# Altium schematic sheet 2312_SchemaBloc.SchDoc
size A3; Author: Miguel Santos; Organization: ETML-ES; Address1: Avenue Recordon 1; Address2: 1004 Lausanne; Address3: Switzerland; SheetNumber: 1; SheetTotal: 7; Version: 1.0
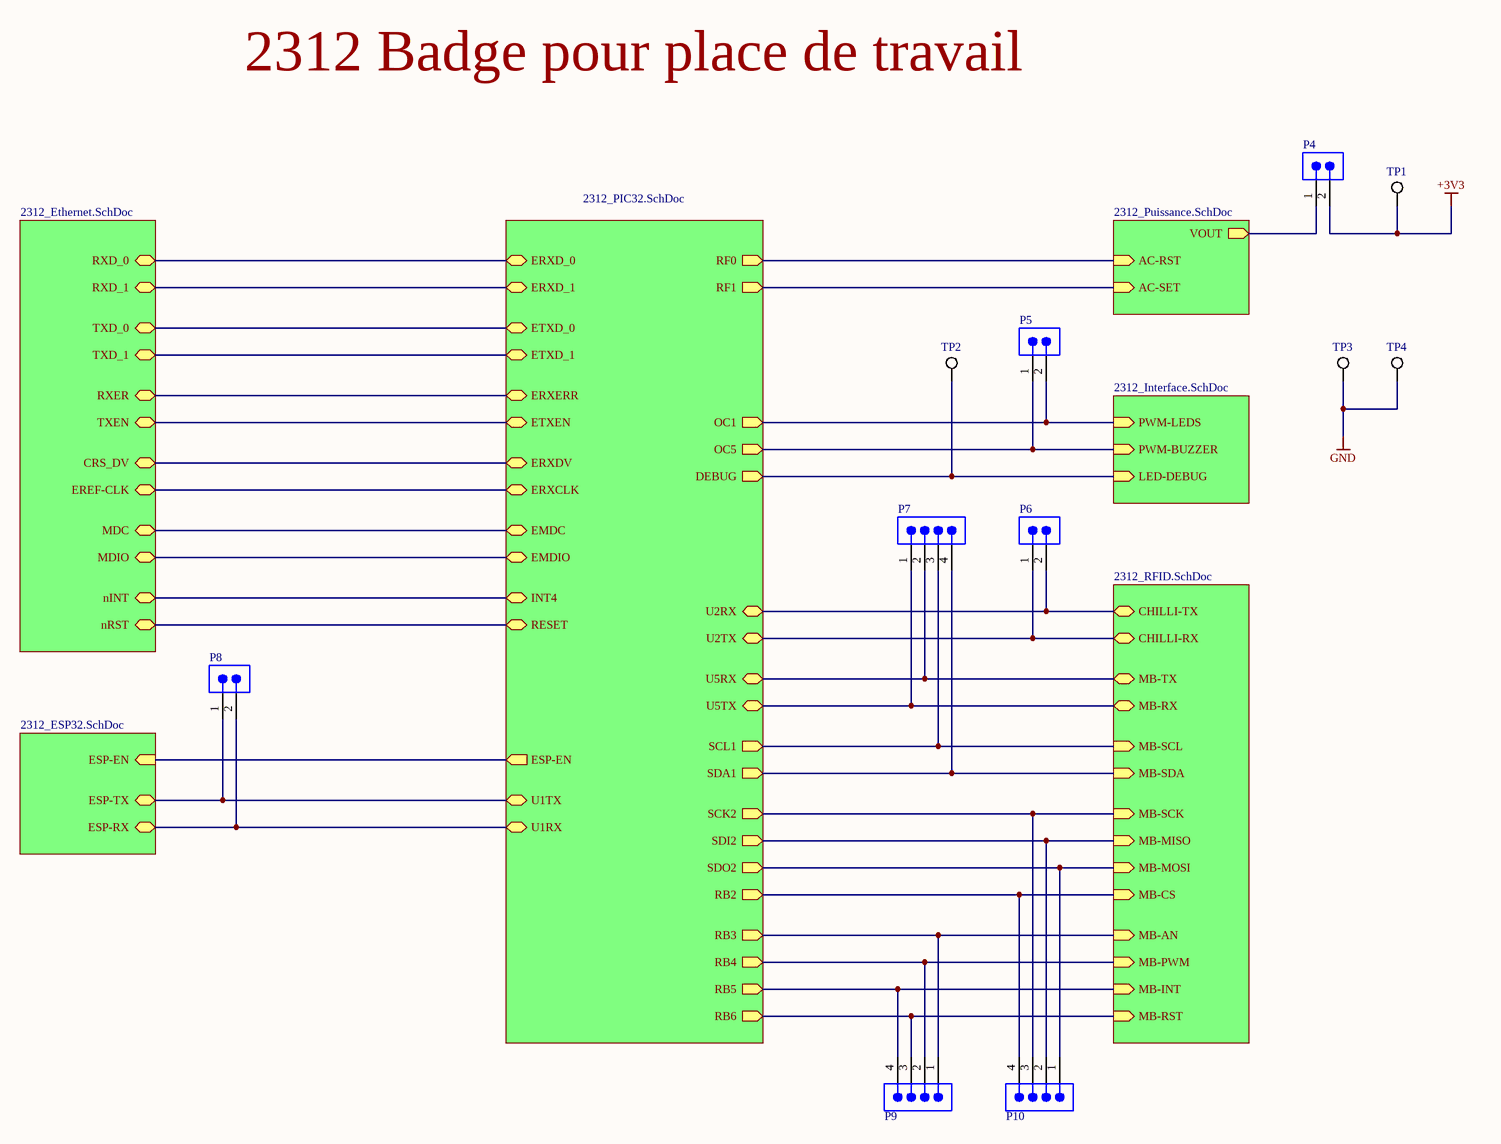
[diagram p0: 2312_SchemaBloc.SchDoc]

## Parts
P4  61300211121  [61300211121]  (value not drawn)
P5  61300211121  [61300211121]  (value not drawn)
P6  61300211121  [61300211121]  (value not drawn)
P7  61300411121  [61300411121]  (value not drawn)
P8  61300211121  [61300211121]  (value not drawn)
P9  61300411121  [61300411121]  (value not drawn)
P10  61300411121  [61300411121]  (value not drawn)
TP1  5019  [KSTN-5019_V]  (value not drawn)
TP2  5019  [KSTN-5019_V]  (value not drawn)
TP3  5019  [KSTN-5019_V]  (value not drawn)
TP4  5019  [KSTN-5019_V]  (value not drawn)

## Sub-sheets
Communication = 2312_RFID.SchDoc: MB-AN (in), MB-RST (in), MB-CS (in), MB-SCK (in), MB-MISO (in), MB-MOSI (in), MB-PWM (in), MB-INT (in), MB-RX (bidir), MB-TX (bidir), MB-SCL (in), MB-SDA (in), CHILLI-RX (bidir), CHILLI-TX (bidir)
ESP32 = 2312_ESP32.SchDoc: ESP-RX (bidir), ESP-EN (in), ESP-TX (bidir)
Ethernet = 2312_Ethernet.SchDoc: CRS_DV (bidir), MDIO (bidir), MDC (bidir), nRST (bidir), RXER (bidir), RXD_0 (bidir), RXD_1 (bidir), nINT (bidir), TXEN (bidir), TXD_0 (bidir), TXD_1 (bidir), EREF-CLK (bidir)
Interface = 2312_Interface.SchDoc: PWM-BUZZER (in), PWM-LEDS (in), LED-DEBUG (in)
Microcontrôleur = 2312_PIC32.SchDoc: ETXEN (bidir), ETXD_0 (bidir), ETXD_1 (bidir), U5RX (bidir), U5TX (bidir), EMDC (bidir), U2RX (bidir), U2TX (bidir), SDA1 (out), SCL1 (out), INT4 (bidir), OC1 (out), EMDIO (bidir), U1RX (bidir), U1TX (bidir), OC5 (out), RF0 (out), RF1 (out), ERXD_1 (bidir), ERXD_0 (bidir), ERXDV (bidir), ERXERR (bidir), RB3 (out), RB4 (out), RB5 (out), RB6 (out), ESP-EN (out), RB2 (out), SCK2 (out), SDI2 (out), SDO2 (out), RESET (bidir), ERXCLK (bidir), DEBUG (out)
Puissance = 2312_Puissance.SchDoc: VOUT (out), AC-SET (in), AC-RST (in)

## Nets
+3V3: P4.2 TP1.1
GND: TP3.1 TP4.1
NetP4_1: P4.1 ; sheet Puissance/VOUT
NetP5_1: P5.1 ; sheet Microcontrôleur/OC5, sheet Interface/PWM-BUZZER
NetP5_2: P5.2 ; sheet Microcontrôleur/OC1, sheet Interface/PWM-LEDS
NetP6_1: P6.1 ; sheet Microcontrôleur/U2TX, sheet Communication/CHILLI-RX
NetP6_2: P6.2 ; sheet Microcontrôleur/U2RX, sheet Communication/CHILLI-TX
NetP7_1: P7.1 ; sheet Microcontrôleur/U5TX, sheet Communication/MB-RX
NetP7_2: P7.2 ; sheet Microcontrôleur/U5RX, sheet Communication/MB-TX
NetP7_3: P7.3 ; sheet Microcontrôleur/SCL1, sheet Communication/MB-SCL
NetP7_4: P7.4 ; sheet Microcontrôleur/SDA1, sheet Communication/MB-SDA
NetP8_1: P8.1 ; sheet Microcontrôleur/U1TX, sheet ESP32/ESP-TX
NetP8_2: P8.2 ; sheet Microcontrôleur/U1RX, sheet ESP32/ESP-RX
NetP9_1: P9.1 ; sheet Microcontrôleur/RB3, sheet Communication/MB-AN
NetP9_2: P9.2 ; sheet Microcontrôleur/RB4, sheet Communication/MB-PWM
NetP9_3: P9.3 ; sheet Microcontrôleur/RB6, sheet Communication/MB-RST
NetP9_4: P9.4 ; sheet Microcontrôleur/RB5, sheet Communication/MB-INT
NetP10_1: P10.1 ; sheet Microcontrôleur/SDO2, sheet Communication/MB-MOSI
NetP10_2: P10.2 ; sheet Microcontrôleur/SDI2, sheet Communication/MB-MISO
NetP10_3: P10.3 ; sheet Microcontrôleur/SCK2, sheet Communication/MB-SCK
NetP10_4: P10.4 ; sheet Microcontrôleur/RB2, sheet Communication/MB-CS
NetTP2_1: TP2.1 ; sheet Microcontrôleur/DEBUG, sheet Interface/LED-DEBUG
(unnamed): sheet Puissance/AC-SET, sheet Microcontrôleur/RF1
(unnamed): sheet Puissance/AC-RST, sheet Microcontrôleur/RF0
(unnamed): sheet Microcontrôleur/ETXEN, sheet Ethernet/TXEN
(unnamed): sheet Microcontrôleur/ETXD_0, sheet Ethernet/TXD_0
(unnamed): sheet Microcontrôleur/ETXD_1, sheet Ethernet/TXD_1
(unnamed): sheet Microcontrôleur/EMDC, sheet Ethernet/MDC
(unnamed): sheet Microcontrôleur/INT4, sheet Ethernet/nINT
(unnamed): sheet Microcontrôleur/EMDIO, sheet Ethernet/MDIO
(unnamed): sheet Microcontrôleur/ERXD_1, sheet Ethernet/RXD_1
(unnamed): sheet Microcontrôleur/ERXD_0, sheet Ethernet/RXD_0
(unnamed): sheet Microcontrôleur/ERXDV, sheet Ethernet/CRS_DV
(unnamed): sheet Microcontrôleur/ERXERR, sheet Ethernet/RXER
(unnamed): sheet Microcontrôleur/ESP-EN, sheet ESP32/ESP-EN
(unnamed): sheet Microcontrôleur/RESET, sheet Ethernet/nRST
(unnamed): sheet Microcontrôleur/ERXCLK, sheet Ethernet/EREF-CLK

## Notes on the sheet
- 2312 Badge pour place de travail
- Fichier :
- a
- Date :
- Heure :
- Version :
- Auteur :
- Modif.
- b
- c
- d
- Projet :
- No :
- Nb feuilles
- Feuille n°
- Chemin :

## Library data of the parts
P4-P6 P8 = 61300211121: WR-PHD Pin Header, THT, Vertical, pitch 2.54mm, 1 Row, 2P; Manufacturer: Wurth Elektronik; Contact Resistance: 20mΩ; Rated Current: 3A; Working Voltage: 250V; Withstanding Voltage: 500V; ComponentLink1Description: Website Link; ComponentLink1URL: https://www.we-online.com/redexpert/article/61300211121?ad; ComponentLink2Description: Datasheet Link; ComponentLink2URL: https://www.we-online.com/redexpert/spec/61300211121?ad; Manufacturer Part Number: 61300211121; Category: Board-to-Board Connectors; Match Code: WR-PHD; Mount: Through Hole; Operating Temperature Max: 105°C; Operating Temperature Min: -40°C; Packaging: Bag; Gender: Pin Header; Number of Pins: 2; Number of Rows: 1; Orientation: Vertical; Pitch: 2.54mm
P7 P9 P10 = 61300411121: WR-PHD Pin Header, THT, Vertical, pitch 2.54mm, 1 Row, 4P; Manufacturer: Wurth Elektronik; Contact Resistance: 20mΩ; Rated Current: 3A; Working Voltage: 250V; Withstanding Voltage: 500V; ComponentLink1Description: Website Link; ComponentLink1URL: https://www.we-online.com/redexpert/article/61300411121?ad; ComponentLink2Description: Datasheet Link; ComponentLink2URL: https://www.we-online.com/redexpert/spec/61300411121?ad; Manufacturer Part Number: 61300411121; Category: Board-to-Board Connectors; Match Code: WR-PHD; Mount: Through Hole; Operating Temperature Max: 105°C; Operating Temperature Min: -40°C; Packaging: Bag; Gender: Pin Header; Number of Pins: 4; Number of Rows: 1; Orientation: Vertical; Pitch: 2.54mm
TP1-TP4 = CMP-1672-00008-1: Test Point, 1 Position SMD, RoHS, Tape and Reel; ComponentLink1Description: Manufacturer URL; Package Quantity: 1000; DatasheetVersion: 03/2014; Packaging: Tape and Reel; ComponentLink2URL: http://www.keyelco.com/product-pdf.cfm?p=1357; ComponentLink1URL: http://www.keyelco.com/; Mount: Surface Mount; Contact Plating: Silver; PackageDescription: 1-Pin Surface Mount Device, Body 3.81 x 2.03 mm; Pins: 1; RoHSCompliant: True; Mounting Technology: Surface Mount; ComponentLink2Description: Datasheet; PackageReference: 5019